# EAGLE design teensy_led_shield_1.1b (EAGLE 5.10)
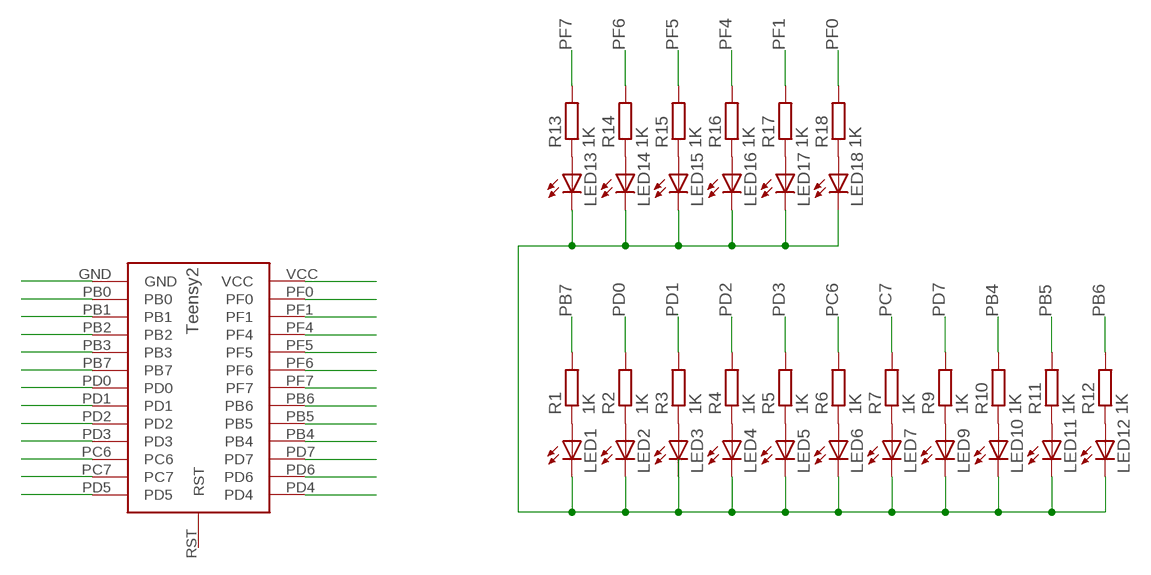
[diagram p0: schematic, sheet 1]

## Parts
LED1  LEDCHIP-LED0603  [CHIP-LED0603]
LED2  LEDCHIP-LED0603  [CHIP-LED0603]
LED3  LEDCHIP-LED0603  [CHIP-LED0603]
LED4  LEDCHIP-LED0603  [CHIP-LED0603]
LED5  LEDCHIP-LED0603  [CHIP-LED0603]
LED6  LEDCHIP-LED0603  [CHIP-LED0603]
LED7  LEDCHIP-LED0603  [CHIP-LED0603]
LED9  LEDCHIP-LED0603  [CHIP-LED0603]
LED10  LEDCHIP-LED0603  [CHIP-LED0603]
LED11  LEDCHIP-LED0603  [CHIP-LED0603]
LED12  LEDCHIP-LED0603  [CHIP-LED0603]
LED13  LEDCHIP-LED0603  [CHIP-LED0603]
LED14  LEDCHIP-LED0603  [CHIP-LED0603]
LED15  LEDCHIP-LED0603  [CHIP-LED0603]
LED16  LEDCHIP-LED0603  [CHIP-LED0603]
LED17  LEDCHIP-LED0603  [CHIP-LED0603]
LED18  LEDCHIP-LED0603  [CHIP-LED0603]
R1  1K  R-EU_R0603  [R0603]
R2  1K  R-EU_R0603  [R0603]
R3  1K  R-EU_R0603  [R0603]
R4  1K  R-EU_R0603  [R0603]
R5  1K  R-EU_R0603  [R0603]
R6  1K  R-EU_R0603  [R0603]
R7  1K  R-EU_R0603  [R0603]
R9  1K  R-EU_R0603  [R0603]
R10  1K  R-EU_R0603  [R0603]
R11  1K  R-EU_R0603  [R0603]
R12  1K  R-EU_R0603  [R0603]
R13  1K  R-EU_R0603  [R0603]
R14  1K  R-EU_R0603  [R0603]
R15  1K  R-EU_R0603  [R0603]
R16  1K  R-EU_R0603  [R0603]
R17  1K  R-EU_R0603  [R0603]
R18  1K  R-EU_R0603  [R0603]
U$1  TEENSY2  [TEENSY2]

## Nets
GND: LED1.C LED2.C LED3.C LED4.C LED5.C LED6.C LED7.C LED9.C LED10.C LED11.C LED12.C LED13.C LED14.C LED15.C LED16.C LED17.C LED18.C U$1.GND
N$1: LED6.A R6.1
N$2: LED13.A R13.1
N$27: LED1.A R1.1
N$28: LED2.A R2.1
N$29: LED3.A R3.1
N$30: LED4.A R4.1
N$31: LED5.A R5.1
N$33: LED7.A R7.1
N$34: LED9.A R9.1
N$35: LED10.A R10.1
N$36: LED11.A R11.1
N$37: LED12.A R12.1
N$39: LED14.A R14.1
N$40: LED15.A R15.1
N$41: LED16.A R16.1
N$42: LED17.A R17.1
N$43: LED18.A R18.1
PB0: U$1.PB0
PB1: U$1.PB1
PB2: U$1.PB2
PB3: U$1.PB3
PB4: R10.2 U$1.PB4
PB5: R11.2 U$1.PB5
PB6: R12.2 U$1.PB6
PB7: R1.2 U$1.PB7
PC6: R6.2 U$1.PC6
PC7: R7.2 U$1.PC7
PD0: R2.2 U$1.PD0
PD1: R3.2 U$1.PD1
PD2: R4.2 U$1.PD2
PD3: R5.2 U$1.PD3
PD4: U$1.PD4
PD5: U$1.PD5
PD6: U$1.PD6
PD7: R9.2 U$1.PD7
PF0: R18.2 U$1.PF0
PF1: R17.2 U$1.PF1
PF4: R16.2 U$1.PF4
PF5: R15.2 U$1.PF5
PF6: R14.2 U$1.PF6
PF7: R13.2 U$1.PF7
VCC: U$1.VCC
Unconnected: U$1.RST

## Library data of the parts
LED1-LED7 LED9-LED18 = led:LED: LED OSRAM: - CHIPLED LG R971, LG N971, LY N971, LG Q971, LY Q971, LO R971, LY R971 LH N974, LH R974 LS Q976, LO Q976, LY Q976 LO Q996 - Hyper CHIPLED LW Q18S LB Q993, LB Q99A, LB R99A - SideLED LS A670, LO A670, LY A670, LG A670, LP A670 LB A673, LV A673, LT A673, LW A673 LH A674 LY A675 LS A676, LA A676, LO A676, LY A676, LW A676 LS A679, LY A679, LG A679 - Hyper Micro SIDELED® LS Y876, LA Y876, LO Y876, LY Y876 LT Y87S - SmartLED LW L88C, LW L88S LB L89C, LB L89S, LG L890 LS L89K, LO L89K, LY L89K LS L896, LA L896, LO L896, LY L896 - TOPLED LS T670, LO T670, LY T670, LG T670, LP T670 LSG T670, LSP T670, LSY T670, LOP T670, LYG T670 LG T671, LOG T671, LSG T671 LB T673, LV T673, LT T673, LW T673 LH T674 LS T676, LA T676, LO T676, LY T676, LB T676, LH T676, LSB T676, LW T676 LB T67C, LV T67C, LT T67C, LS T67K, LO T67K, LY T67K, LW E67C LS E67B, LA E67B, LO E67B, LY E67B, LB E67C, LV E67C, LT E67C LW T67C LS T679, LY T679, LG T679 LS T770, LO T770, LY T770, LG T770, LP T770 LB T773, LV T773, LT T773, LW T773 LH T774 LS E675, LA E675, LY E675, LS T675 LS T776, LA T776, LO T776, LY T776, LB T776 LHGB T686 LT T68C, LB T68C - Hyper Mini TOPLED® LB M676 - Mini TOPLED Santana® LG M470 LS M47K, LO M47K, LY M47K Source: http://www.osram.convergy.de LUXEON: - LUMILED® LXK2-PW12-R00, LXK2-PW12-S00, LXK2-PW14-U00, LXK2-PW14-V00 LXK2-PM12-R00, LXK2-PM12-S00, LXK2-PM14-U00 LXK2-PE12-Q00, LXK2-PE12-R00, LXK2-PE12-S00, LXK2-PE14-T00, LXK2-PE14-U00 LXK2-PB12-K00, LXK2-PB12-L00, LXK2-PB12-M00, LXK2-PB14-N00, LXK2-PB14-P00, LXK2-PB14-Q00 LXK2-PR12-L00, LXK2-PR12-M00, LXK2-PR14-Q00, LXK2-PR14-R00 LXK2-PD12-Q00, LXK2-PD12-R00, LXK2-PD12-S00 LXK2-PH12-R00, LXK2-PH12-S00 LXK2-PL12-P00, LXK2-PL12-Q00, LXK2-PL12-R00 Source: www.luxeon.com KINGBRIGHT: KA-3528ASYC Source: www.kingbright.com
R1-R7 R9-R18 = resistor:R-EU_: RESISTOR, European symbol
U$1 = janesmae_com:TEENSY2

## Board
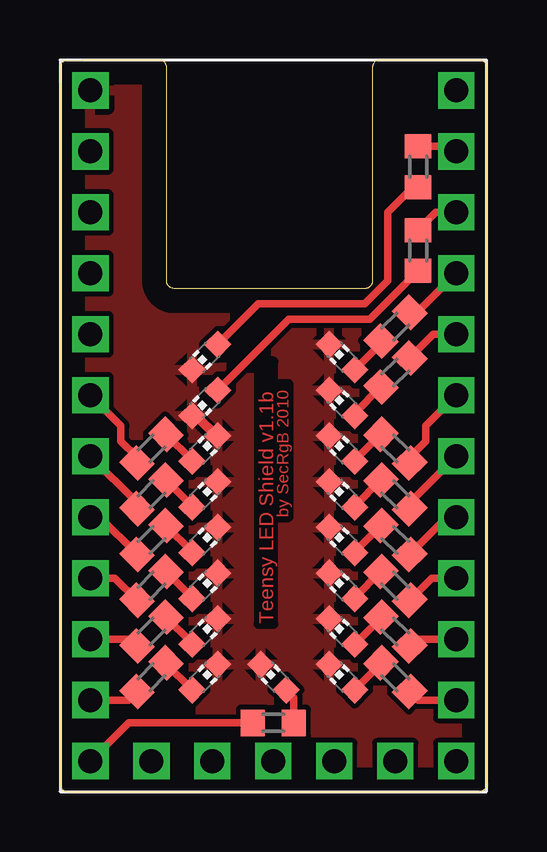
[diagram p1: board, top side]
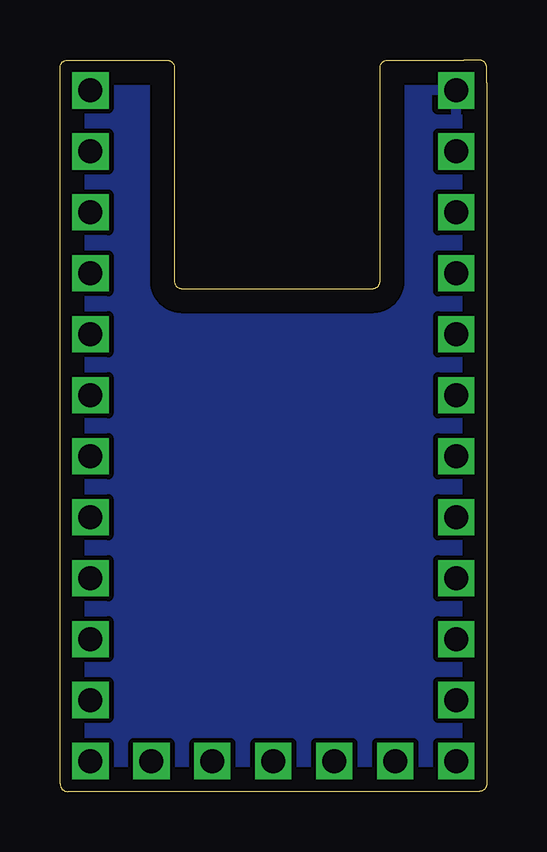
[diagram p2: board, bottom side, seen from below]

Size 17.78 x 30.48 mm. Coordinates in mm from the lower left corner, seen from the top.
Outline: 4.76,20.95 arc-90 4.45,21.27
Outline: 4.45,21.27 4.45,30.16 arc90 4.13,30.48 0.95,30.48 0.32,30.48 arc90 0,30.16 0,29.53 0,0.32 arc90 0.32,0 17.46,0 arc90 17.78,0.32 17.78,30.16 arc90 17.46,30.48 13.34,30.48 arc90 13.02,30.16 13.02,21.27 arc-90 12.7,20.95 4.76,20.95
Outline: 4.76,20.95 arc-90 4.45,21.27
Copper layers (1*16): Top 0.035mm / dielectric 1.5mm / Bottom 0.035mm
Design rules "default": minimum track width 10mil, minimum drill 24mil, track to track 8mil, track to pad 8mil, pad to pad 8mil, via to via 8mil, smd to smd 8mil, copper to edge 40mil, drill to drill 8mil, minimum pad ring 10mil, minimum via ring 8mil, stop-mask expansion 4mil, vias tented up to drill 0mil, thermal gap 10mil

### Footprints (pad centres in the part's own frame; a part is rotated, then mirrored left to right if it is on the bottom)
CHIP-LED0603 = smd 0.8 x 0.8: A 0,-0.75; C 0,0.75
R0603 = smd 1 x 1.1: 1 -0.85,0; 2 0.85,0
TEENSY2 = drill 1 square: GND -7.62,13.97; GND2 0,-13.97; PB0 -7.62,11.43; PB1 -7.62,8.89; PB2 -7.62,6.35; PB3 -7.62,3.81; PB4 7.62,-8.89; PB5 7.62,-6.35; PB6 7.62,-3.81; PB7 -7.62,1.27; PC6 -7.62,-11.43; PC7 -7.62,-13.97; PD0 -7.62,-1.27; PD1 -7.62,-3.81; PD2 -7.62,-6.35; PD3 -7.62,-8.89; PD4 5.08,-13.97; PD5 -5.08,-13.97; PD6 7.62,-13.97; PD7 7.62,-11.43; PF0 7.62,11.43; PF1 7.62,8.89; PF4 7.62,6.35; PF5 7.62,3.81; PF6 7.62,1.27; PF7 7.62,-1.27; RST 2.54,-13.97; VCC 7.62,13.97; VCC2 -2.54,-13.97

### Placement (x,y rotation side)
LED1  6.03,14.29 315 top
LED2  6.03,12.38 315 top
LED3  6.03,10.48 315 top
LED4  6.03,8.57 315 top
LED5  6.03,6.67 315 top
LED6  6.03,4.76 315 top
LED7  8.89,4.76 45 top
LED9  11.75,4.76 45 top
LED10  11.75,6.67 45 top
LED11  11.75,8.57 45 top
LED12  11.75,10.48 45 top
LED13  11.75,12.38 45 top
LED14  11.75,14.29 45 top
LED15  11.75,16.19 45 top
LED16  11.75,18.1 45 top
LED17  6.03,16.19 135 top
LED18  6.03,18.1 135 top
R1  3.81,14.29 225 top
R2  3.81,12.38 225 top
R3  3.81,10.48 225 top
R4  3.81,8.57 225 top
R5  3.81,6.67 225 top
R6  3.81,4.76 225 top
R7  8.89,2.86 180 top
R9  13.97,4.76 315 top
R10  13.97,6.67 315 top
R11  13.97,8.57 315 top
R12  13.97,10.48 315 top
R13  13.97,12.38 315 top
R14  13.97,14.29 315 top
R15  13.97,17.46 45 top
R16  13.97,19.37 45 top
R17  14.92,22.54 90 top
R18  14.92,26.04 90 top
U$1  8.89,15.24 0 top

### Tracks (layer width: path | path; a pad name or v marks a point on that pad's centre or on a via)
GND
  Top 0.305: LED17.C 5.72,15.66 LED1.C
  pour Top: 0.64,29.84 0.64,0.64 17.14,0.64 17.14,29.84
  pour Bottom: 0.64,29.84 17.14,29.84 17.14,0.64 0.64,0.64
N$1
  Top 0.305: R6.1 4.41,5.32 LED6.A
N$2
  Top 0.305: LED13.A 12.28,11.89 R13.1
N$4
  Top 0.305: 6.35,14.92 5.71,15.56
N$27
  Top 0.305: R1.1 5.5,13.8 LED1.A
N$28
  Top 0.305: R2.1 5.5,11.89 LED2.A
N$29
  Top 0.305: R3.1 5.5,9.99 LED3.A
N$30
  Top 0.305: R4.1 5.5,8.08 LED4.A
N$31
  Top 0.305: R5.1 5.5,6.18 LED5.A
N$33
  Top 0.305: LED7.A 9.74,3.91 R7.1
N$34
  Top 0.305: LED9.A 13.37,5.32 R9.1
N$35
  Top 0.305: R10.1 13.37,7.23 LED10.A
N$36
  Top 0.305: LED11.A 12.28,8.08 R11.1
N$37
  Top 0.305: LED12.A 12.28,9.99 R12.1
N$39
  Top 0.305: LED14.A 12.28,13.8 R14.1
N$40
  Top 0.305: LED15.A 12.28,15.77 R15.1
N$41
  Top 0.305: R16.1 13.37,18.66 LED16.A
N$42
  Top 0.305: R17.1 12.91,19.68 9.53,19.68 LED17.A
N$43
  Top 0.305: R18.1 14.71,25.18 13.65,24.13 13.65,21.27 12.7,20.32 8.26,20.32 LED18.A
PB4
  Top 0.305: U$1.PB4 14.86,6.35 R10.2
PB5
  Top 0.305: U$1.PB5 15.49,8.89 R11.2
PB6
  Top 0.305: U$1.PB6 16.12,11.43 R12.2
PB7
  Top 0.305: R1.2 3.21,13.94 2.54,14.61 2.54,15.24 U$1.PB7
PC6
  Top 0.305: R6.2 2.86,3.81 U$1.PC6
PC7
  Top 0.305: R7.2 2.86,2.86 U$1.PC7
PD0
  Top 0.305: R2.2 3.21,12.03 U$1.PD0
PD1
  Top 0.305: R3.2 1.66,11.43 U$1.PD1
PD2
  Top 0.305: R4.2 2.29,8.89 U$1.PD2
PD3
  Top 0.305: R5.2 2.92,6.35 U$1.PD3
PD7
  Top 0.305: U$1.PD7 14.92,3.81 R9.2
PF0
  Top 0.305: U$1.PF0 16.3,26.89 R18.2
PF1
  Top 0.305: U$1.PF1 15.66,24.13 R17.2
PF4
  Top 0.305: U$1.PF4 14.89,19.97 R16.2
PF5
  Top 0.305: U$1.PF5 15.56,19.05 R15.2
PF6
  Top 0.305: R14.2 14.57,13.94 15.24,14.61 15.24,15.24 U$1.PF6
PF7
  Top 0.305: R13.2 14.57,12.03 U$1.PF7

### Text on the board
Top: by SecRgB 2010 | Teensy LED Shield v1.1b